# Altium schematic sheet timer_main.SchDoc
size A3; DocumentNumber: 1; SheetNumber: 1; SheetTotal: 3
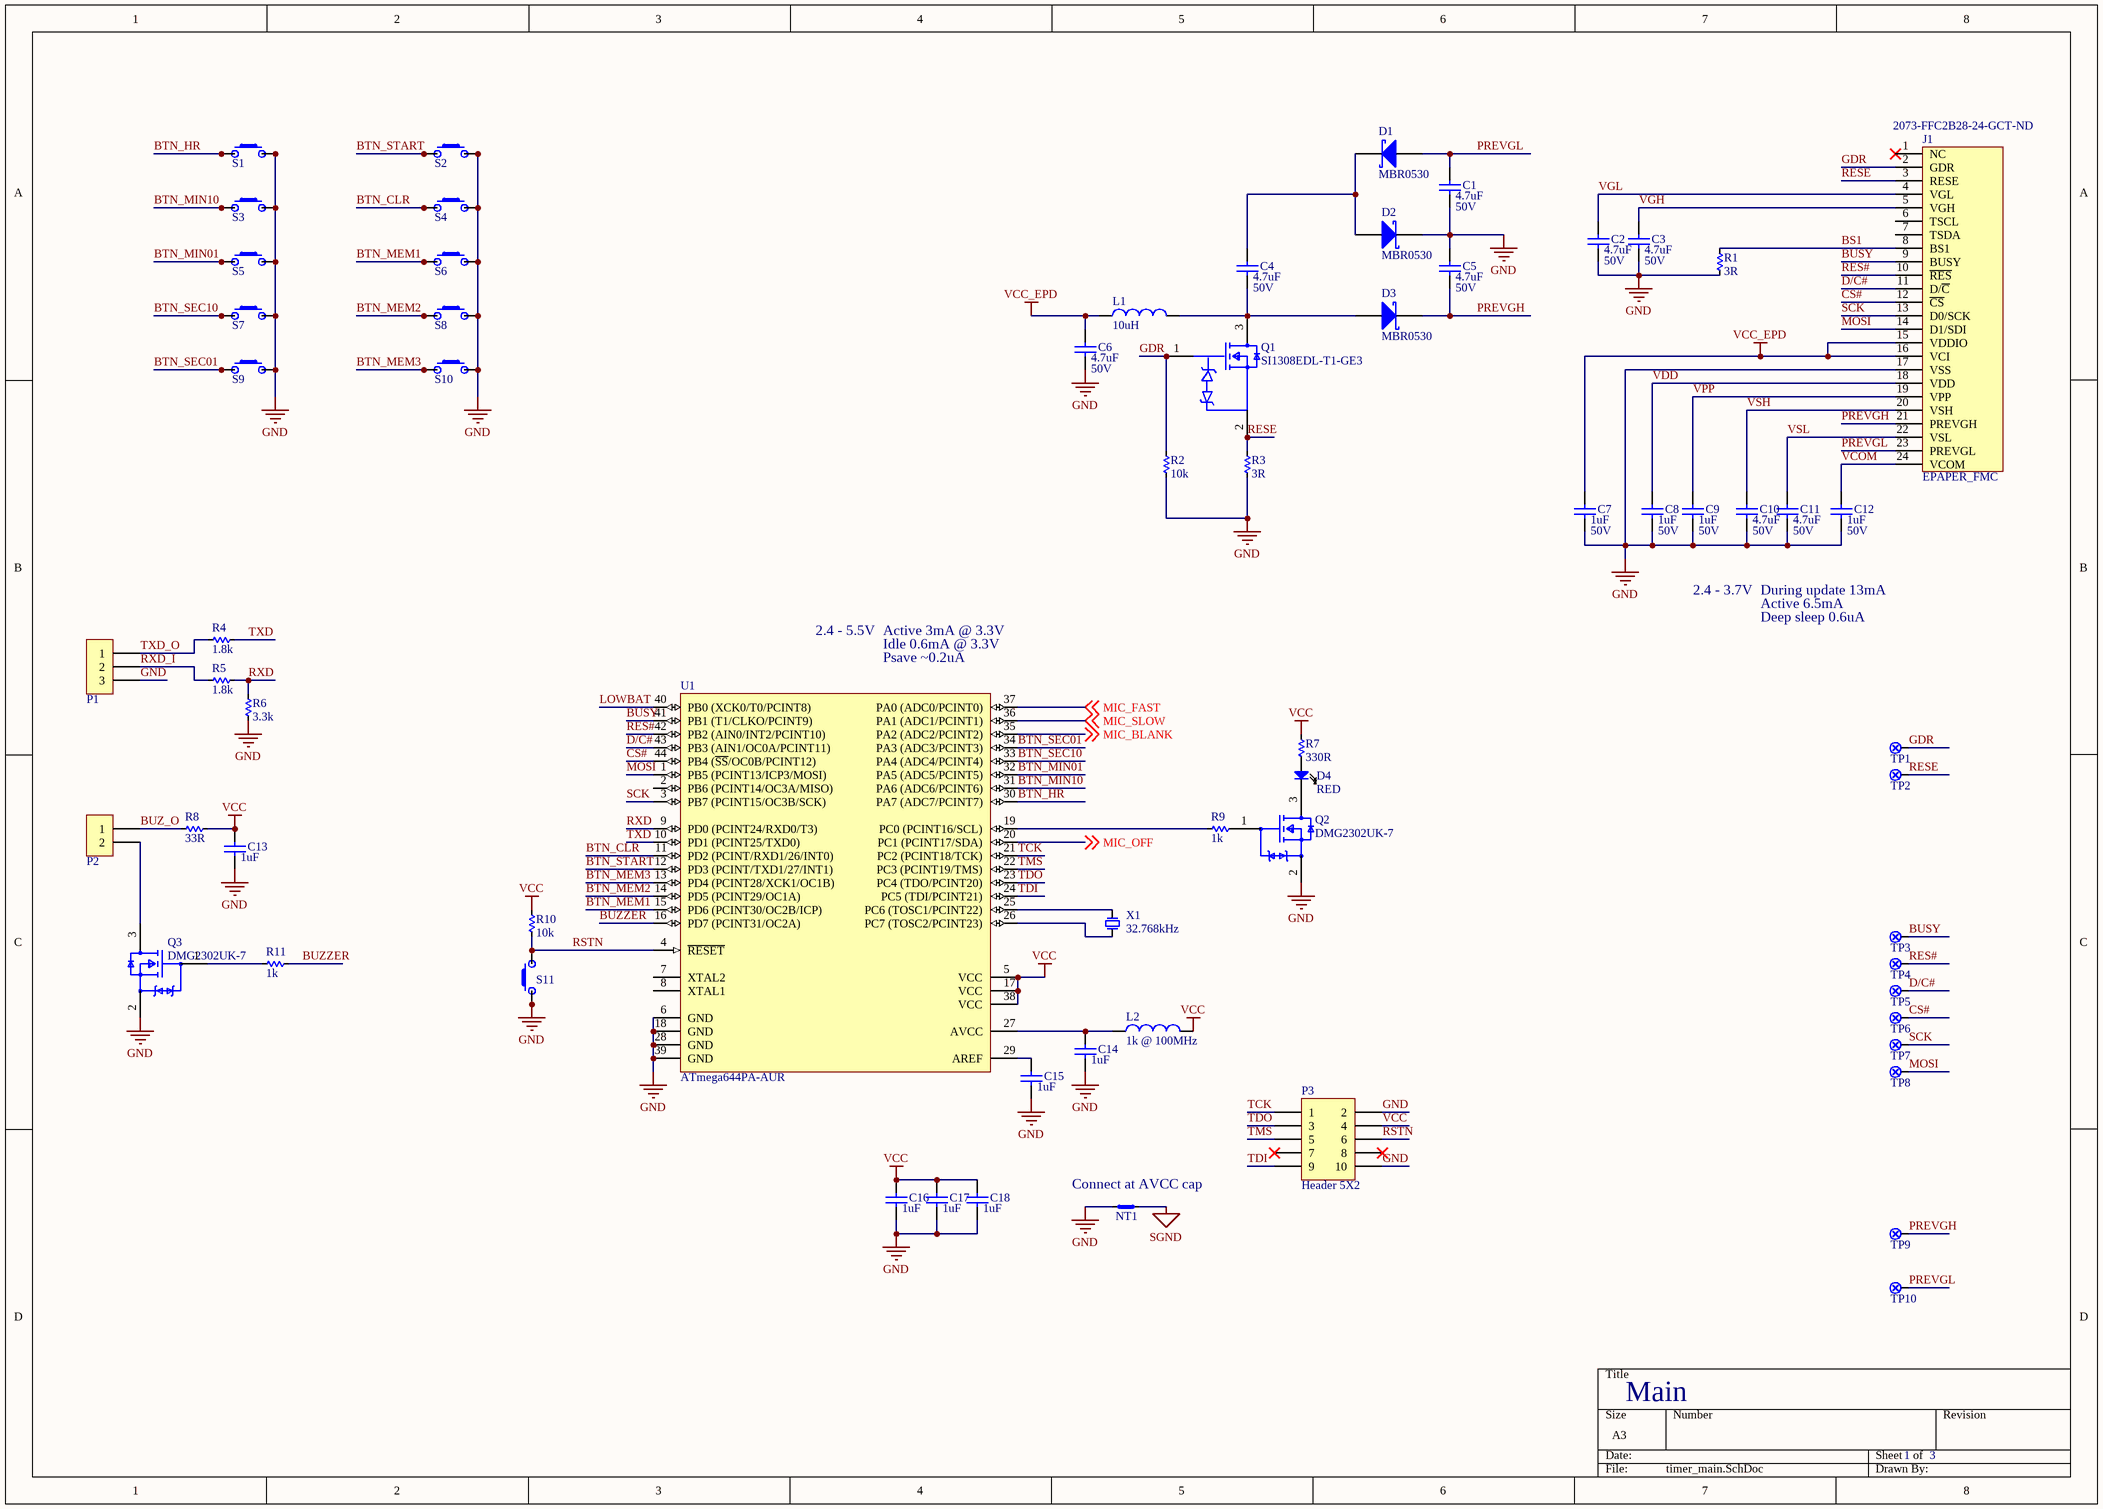
[diagram p0: timer_main.SchDoc]

## Parts
C1  value 4.7uF  Voltage: 50V  [C0805/2012]  (hidden comment: CAP)
C2  value 4.7uF  Voltage: 50V  [C0805/2012]  (hidden comment: CAP)
C3  value 4.7uF  Voltage: 50V  [C0805/2012]  (hidden comment: CAP)
C4  value 4.7uF  Voltage: 50V  [C0805/2012]  (hidden comment: CAP)
C5  value 4.7uF  Voltage: 50V  [C0805/2012]  (hidden comment: CAP)
C6  value 4.7uF  Voltage: 50V  [C0805/2012]  (hidden comment: CAP)
C7  value 1uF  Voltage: 50V  [C0603/1608]  (hidden comment: CAP)
C8  value 1uF  Voltage: 50V  [C0603/1608]  (hidden comment: CAP)
C9  value 1uF  Voltage: 50V  [C0603/1608]  (hidden comment: CAP)
C10  value 4.7uF  Voltage: 50V  [C0805/2012]  (hidden comment: CAP)
C11  value 4.7uF  Voltage: 50V  [C0805/2012]  (hidden comment: CAP)
C12  value 1uF  Voltage: 50V  [C0603/1608]  (hidden comment: CAP)
C13  value 1uF  [C0603/1608]  (hidden comment: CAP)
C14  value 1uF  [C0603/1608]  (hidden comment: CAP)
C15  value 1uF  [C0603/1608]  (hidden comment: CAP)
C16  value 1uF  [C0603/1608]  (hidden comment: CAP)
C17  value 1uF  [C0603/1608]  (hidden comment: CAP)
C18  value 1uF  [C0603/1608]  (hidden comment: CAP)
D1  MBR0530  [FAIR-SOD123-2_V]
D2  MBR0530  [FAIR-SOD123-2_V]
D3  MBR0530  [FAIR-SOD123-2_V]
D4  value RED  [0603/1608_P]  (hidden comment: LED)
J1  EPAPER_FMC  Supplier Part Number 1: 2073-FFC2B28-24-GCT-ND  [FFC2B28-24-G REV]
L1  value 10uH  [IND4x4mm]  (hidden comment: IND)
L2  value 1k @ 100MHz  [R0603/1608]  (hidden comment: FERRITE)
NT1  NET_TIE2  [NT2_0.5mm]  (value not drawn)  (net tie, no BOM)
P1  SIL3  [PINS-3]  (value not drawn)
P2  SIL2  [PINS-2]  (value not drawn)
P3  Header 5X2  [HDR2X5]
Q1  SI1308EDL-T1-GE3  [FP-S-03946-MFG]
Q2  DMG2302UK-7  [FP-SOT23-MFG]
Q3  DMG2302UK-7  [FP-SOT23-MFG]
R1  value 3R  [R0603/1608]  (hidden comment: RES)
R2  value 10k  [R0603/1608]  (hidden comment: RES)
R3  value 3R  [R0603/1608]  (hidden comment: RES)
R4  value 1.8k  [R0603/1608]  (hidden comment: RES)
R5  value 1.8k  [R0603/1608]  (hidden comment: RES)
R6  value 3.3k  [R0603/1608]  (hidden comment: RES)
R7  value 330R  [R0603/1608]  (hidden comment: RES)
R8  value 33R  [R0603/1608]  (hidden comment: RES)
R9  value 1k  [R0603/1608]  (hidden comment: RES)
R10  value 10k  [R0603/1608]  (hidden comment: RES)
R11  value 1k  [R0603/1608]  (hidden comment: RES)
S1  SW  [SW-PTS645-SMT]  (value not drawn)
S2  SW  [SW-PTS645-SMT]  (value not drawn)
S3  SW  [SW-PTS645-SMT]  (value not drawn)
S4  SW  [SW-PTS645-SMT]  (value not drawn)
S5  SW  [SW-PTS645-SMT]  (value not drawn)
S6  SW  [SW-PTS645-SMT]  (value not drawn)
S7  SW  [SW-PTS645-SMT]  (value not drawn)
S8  SW  [SW-PTS645-SMT]  (value not drawn)
S9  SW  [SW-PTS645-SMT]  (value not drawn)
S10  SW  [SW-PTS645-SMT]  (value not drawn)
S11  SW  [SW-PTS645-SMT]  (value not drawn)
TP1  TP  [TP-1.0]  (value not drawn)  (no BOM)
TP2  TP  [TP-1.0]  (value not drawn)  (no BOM)
TP3  TP  [TP-1.0]  (value not drawn)  (no BOM)
TP4  TP  [TP-1.0]  (value not drawn)  (no BOM)
TP5  TP  [TP-1.0]  (value not drawn)  (no BOM)
TP6  TP  [TP-1.0]  (value not drawn)  (no BOM)
TP7  TP  [TP-1.0]  (value not drawn)  (no BOM)
TP8  TP  [TP-1.0]  (value not drawn)  (no BOM)
TP9  TP  [TP-1.0]  (value not drawn)  (no BOM)
TP10  TP  [TP-1.0]  (value not drawn)  (no BOM)
U1  ATmega644PA-AUR  [44A_N]
X1  value 32.768kHz  [CMR200T]  (hidden comment: XTAL)

## Nets
GND: C1.1 C2.1 C3.1 C5.2 C6.1 C7.1 C8.1 C9.1 C10.1 C11.1 C12.1 C13.1 C14.1 C15.1 C16.1 C17.1 C18.1 D2.2(K) J1.17(VSS) NT1.1 P1.3 P3.2 P3.10 Q2.2(S) Q3.2(S) R1.2 R2.2 R3.2 R6.2 S1.3 S1.4 S2.3 S2.4 S3.3 S3.4 S4.3 S4.4 S5.3 S5.4 S6.3 S6.4 S7.3 S7.4 S8.3 S8.4 S9.3 S9.4 S10.3 S10.4 S11.1 S11.2 U1.6(GND) U1.18(GND) U1.28(GND) U1.39(GND)
SGND: NT1.2
VCC: C13.2 C16.2 C17.2 C18.2 L2.2 P3.4 R7.1 R8.2 R10.1 U1.5(VCC) U1.17(VCC) U1.38(VCC)
VCC_EPD: C6.2 C7.2 J1.15(VDDIO) J1.16(VCI) L1.1
BS1: J1.8(BS1) R1.1
BTN_CLR: S4.1 S4.2 U1.11(PD2_(PCINT/RXD1/26/INT0))
BTN_HR: S1.1 S1.2 U1.30(PA7_(ADC7/PCINT7))
BTN_MEM1: S6.1 S6.2 U1.15(PD6_(PCINT30/OC2B/ICP))
BTN_MEM2: S8.1 S8.2 U1.14(PD5_(PCINT29/OC1A))
BTN_MEM3: S10.1 S10.2 U1.13(PD4_(PCINT28/XCK1/OC1B))
BTN_MIN01: S5.1 S5.2 U1.32(PA5_(ADC5/PCINT5))
BTN_MIN10: S3.1 S3.2 U1.31(PA6_(ADC6/PCINT6))
BTN_SEC01: S9.1 S9.2 U1.34(PA3_(ADC3/PCINT3))
BTN_SEC10: S7.1 S7.2 U1.33(PA4_(ADC4/PCINT4))
BTN_START: S2.1 S2.2 U1.12(PD3_(PCINT/TXD1/27/INT1))
BUSY: J1.9(BUSY) TP3.0 U1.41(PB1_(T1/CLKO/PCINT9))
BUZ_O: P2.1 R8.1
BUZZER: R11.2 U1.16(PD7_(PCINT31/OC2A))
CS#: J1.12(~{CS}) TP6.0 U1.44(PB4_(~{SS}/OC0B/PCINT12))
D/C#: J1.11(D/~{C}) TP5.0 U1.43(PB3_(AIN1/OC0A/PCINT11))
GDR: J1.2(GDR) Q1.1(G) R2.1 TP1.0
LOWBAT: U1.40(PB0_(XCK0/T0/PCINT8))
MIC_BLANK: U1.35(PA2_(ADC2/PCINT2)) ; off-sheet MIC_BLANK
MIC_FAST: U1.37(PA0_(ADC0/PCINT0)) ; off-sheet MIC_FAST
MIC_OFF: U1.20(PC1_(PCINT17/SDA)) ; off-sheet MIC_OFF
MIC_SLOW: U1.36(PA1_(ADC1/PCINT1)) ; off-sheet MIC_SLOW
MOSI: J1.14(D1/SDI) TP8.0 U1.1(PB5_(PCINT13/ICP3/MOSI))
PREVGH: C5.1 D3.2(K) J1.21(PREVGH) TP9.0
PREVGL: C1.2 D1.1(A) J1.23(PREVGL) TP10.0
RES#: J1.10(~{RES}) TP4.0 U1.42(PB2_(AIN0/INT2/PCINT10))
RESE: J1.3(RESE) Q1.2(S) R3.1 TP2.0
RSTN: P3.6 R10.2 S11.3 S11.4 U1.4(~{RESET})
RXD: R5.2 R6.1 U1.9(PD0_(PCINT24/RXD0/T3))
RXD_I: P1.2 R5.1
SCK: J1.13(D0/SCK) TP7.0 U1.3(PB7_(PCINT15/OC3B/SCK))
TCK: P3.1 U1.21(PC2_(PCINT18/TCK))
TDI: P3.9 U1.24(PC5_(TDI/PCINT21))
TDO: P3.3 U1.23(PC4_(TDO/PCINT20))
TMS: P3.5 U1.22(PC3_(PCINT19/TMS))
TXD: R4.2 U1.10(PD1_(PCINT25/TXD0))
TXD_O: P1.1 R4.1
VCOM: C12.2 J1.24(VCOM)
VDD: C8.2 J1.18(VDD)
VGH: C3.2 J1.5(VGH)
VGL: C2.2 J1.4(VGL)
VPP: C9.2 J1.19(VPP)
VSH: C10.2 J1.20(VSH)
VSL: C11.2 J1.22(VSL)
NetC4_1: C4.1 D3.1(A) L1.2 Q1.3(D)
NetC4_2: C4.2 D1.2(K) D2.1(A)
NetC14_2: C14.2 L2.1 U1.27(AVCC)
NetC15_2: C15.2 U1.29(AREF)
NetD4_1: D4.1 R7.2
NetD4_2: D4.2 Q2.3(D)
NetP2_2: P2.2 Q3.3(D)
NetQ2_1: Q2.1(G) R9.2
NetQ3_1: Q3.1(G) R11.1
NetR9_1: R9.1 U1.19(PC0_(PCINT16/SCL))
NetU1_25: U1.25(PC6_(TOSC1/PCINT22)) X1.2
NetU1_26: U1.26(PC7_(TOSC2/PCINT23)) X1.1

Not connected (* = marked no-connect by the designer): J1 1(NC)* 6(TSCL) 7(TSDA); P3 7* 8*; U1 2(PB6_(PCINT14/OC3A/MISO)) 7(XTAL2) 8(XTAL1)

## Notes on the sheet
- 2.4 - 5.5V
- Active 3mA @ 3.3V
- Idle 0.6mA @ 3.3V
- 2.4 - 3.7V
- Active 6.5mA
- Deep sleep 0.6uA
- During update 13mA
- (near U1) Psave ~0.2uA
- (near NT1) Connect at AVCC cap
- Main

## Library data of the parts
C1-C12 = CAP: Capacitor; Tolerance: x%; Type: X5R/X7R
C13-C18 = CAP: Capacitor; Tolerance: x%; Voltage: 6.3V; Type: X5R/X7R
D1-D3 = CMP-2000-05113-1: Diode Schottky 30V 0.5A 2-Pin SOD-123 T/R; Manufacturer: Fairchild; Speed: FastRecovery=200mA(Io); Voltage - Forward (Vf) (Max) @ If: 430mV@500mA; Online Catalog: SchottkyDiode; Current - Reverse Leakage @ Vr: 130µA@30V; Current - Average Rectified (Io): 500mA; Other Names: MBR0530CT; Reverse Recovery Time (trr): -; Category: DiscreteSemiconductorProducts; Package / Case: SOD-123; Capacitance @ Vr, F: -; Operating Temperature - Junction: -65degC~125degC; Standard Package: 1; Packaging: CutTape(CT); Family: Diodes,Rectifiers-Single; Diode Type: Schottky; Series: -; Datasheet Version: Rev. 1.1.0, 10/2014; Supplier Device Package: SOD-123; Mounting Type: SurfaceMount; Datasheet URL: https://www.fairchildsemi.com/datasheets/MB/MBR0530.pdf; Manufacturer URL: https://www.fairchildsemi.com/; Voltage - DC Reverse (Vr) (Max): 30V
J1 = EPAPER_FMC: FMC connector for epaper display from Dailan Good Display; Supplier 1: Digi-Key
L1 L2 = IND: Inductor
NT1 = NET_TIE2: Link between nets
P1 = SIL3: SIL package, 3 pins
P2 = SIL2: SIL package, 2 pins
P3 = Header 5X2: Header, 5-Pin, Dual row; LatestRevisionDate: 17-Jul-2002; LatestRevisionNote: Re-released for DXP Platform.; Publisher: Altium Limited
Q1 = CMP-02550-000099-1: MOSFET N-CH 30V 1.4A SC-70-3; Manufacturer: Vishay; Threshold Vgs Max: 1.5V; Turn On Delay Time: 2ns; Gate Charge At Vgs: 2.7nC @ 10V; Typ Forward Diode Voltage: 0.8V; Gate To Source Voltage: 12V; Max Junction Temp: +150°C; Pulse Drain Current: 6A; Threshold Vgs Min: 0.6V; Number Of Channels: 1; Transconductance: 5S; Continuous Drain Current: 1.5A; Rthja Max: 250°C/W; Turn Off Delay Time: 8ns; Power Dissipation: 0.4W; Input Capacitace At Vds: 105pF @ 15V; Max Forward Diode Voltage: 1.2V; Reverse Recovery Charge: 3nC; Depletion Mode: False; Drain To Source Resistance: 0.11Ω; Height: 1.1mm; Lead Free: Yes; Ipc Land Pattern Name: SOT65P210X100-3; Drain To Source Voltage: 30V; Mouser Description: MOSFET 30V 1.5A; Temperature Range Low: -55°C; ComponentLink2URL: http://www.vishay.com/docs/63399/si1308edl.pdf; Package: S-03946; RoHS: TRUE; Device Class L1: Discrete Semiconductors; Manufacturer Part Number: SI1308EDL-T1-GE3; Category: Trans; Number Of N Channels: 1; Temperature Range High: +150°C; Octopart: https://octopart.com/si1308edl-t1-ge3-vishay-45284459; Automotive: No; Digikey Description: MOSFET N-CH 30V 1.4A SC-70-3; ComponentLink2Description: Datasheet; Device Class L3: MOSFETs; Reverse Recovery Time: 8ns; Device Class L2: Transistors; Drain To Source Breakdown Voltage: 30V; Temperature: -55°C to +150°C
Q2 Q3 = CMP-12801-000001-1: MOSFET N-CH 20V 2.8A SOT23; Manufacturer: Diodes Inc.; Reverse Recovery Time: 5.3ns; Gate Charge At Vgs: 2.8nC @ 10V; Turn On Delay Time: 0.6ns; Pulse Drain Current: 12A; Max Forward Diode Voltage: 1.2V; Reverse Recovery Charge: 0.5nC; Automotive Grade: Grade 0; Threshold Vgs Min: 0.3V; Number Of N Channels: 1; Standoff Height: 0.013mm; Typ Forward Diode Voltage: 0.7V; Drain To Source Resistance: 61mΩ; Rthja Max: 192°C/W; Max Junction Temp: +150°C; Input Capacitace At Vds: 130pF @ 10V; Threshold Vgs Max: 1V; Turn Off Delay Time: 4.2ns; Depletion Mode: False; Gate To Source Voltage: 12V; Power Dissipation: 0.66W; Device Class L1: Discrete Semiconductors; Footprint Url: https://www.diodes.com/assets/Package-Files/SOT23.pdf; Lead Free: Yes; Manufacturer Part Number: DMG2302UK-7; Temperature Range High: +150°C; Drain To Source Voltage: 20V; Category: Trans; Digikey Description: MOSFET N-CH 20V 2.8A SOT23; RoHS: TRUE; Device Class L2: Transistors; Height: 1.1mm; Automotive: Yes; Package: SOT23; Drain To Source Breakdown Voltage: 20V; Continuous Drain Current: 2.8A; ComponentLink2Description: Datasheet; Device Class L3: MOSFETs; Octopart: https://octopart.com/dmg2302uk-7-diodes+inc.-73850182; Temperature Range Low: -55°C; Temperature: -55°C to +150°C; Number Of Channels: 1; ComponentLink2URL: https://www.diodes.com/assets/Datasheets/DMG2302UK.pdf
R1-R11 = RES: Resistor; Tolerance: x%
S1-S11 = SW-PB: Switch; Supplier 1: Digi-Key; Supplier Part Number 1: CKN9088CT-ND
TP1-TP10 = TP: Test point
U1 = CMP-0095-00266-2: 8-bit AVR Microcontroller, 64KB Flash, 2KB EEPROM, 4KB SRAM, 44-pin TQFP, Industrial Grade (-40°C to 85°C), Reel; ComponentLink3URL: http://www.atmel.com/dyn/resources/prod_documents/8272S.pdf; ComponentLink2Description: ATmega164A/164PA/324A/324PA/644A/644PA/1284/1284P Datasheet; ComponentLink2URL: http://www.atmel.com/dyn/resources/prod_documents/doc8272.pdf; PackageVersion: revC, Oct-2010; Code_JEDEC: MS-026-ACB; DatasheetVersion: revC, Jun-2011; PackageDescription: 44-Pin Plastic Thin Profile Quad Flat Pack, 10 x 10 x 1.0 mm Body, 0.8 mm Pitch (TQFP); ComponentLink1URL: http://www.atmel.com/; PackageReference: 44A; ComponentLink3Description: ATmega164A/164PA/324A/324PA/644A/644PA/1284/1284P Summary; ComponentLink1Description: Manufacturer URL; RevisionNote: DatasheetVersion & PackageVersion updated. Sch pin names updated. URLs added.
X1 = XTAL: Crystal